# EAGLE design usv_board (EAGLE 8.4.2)
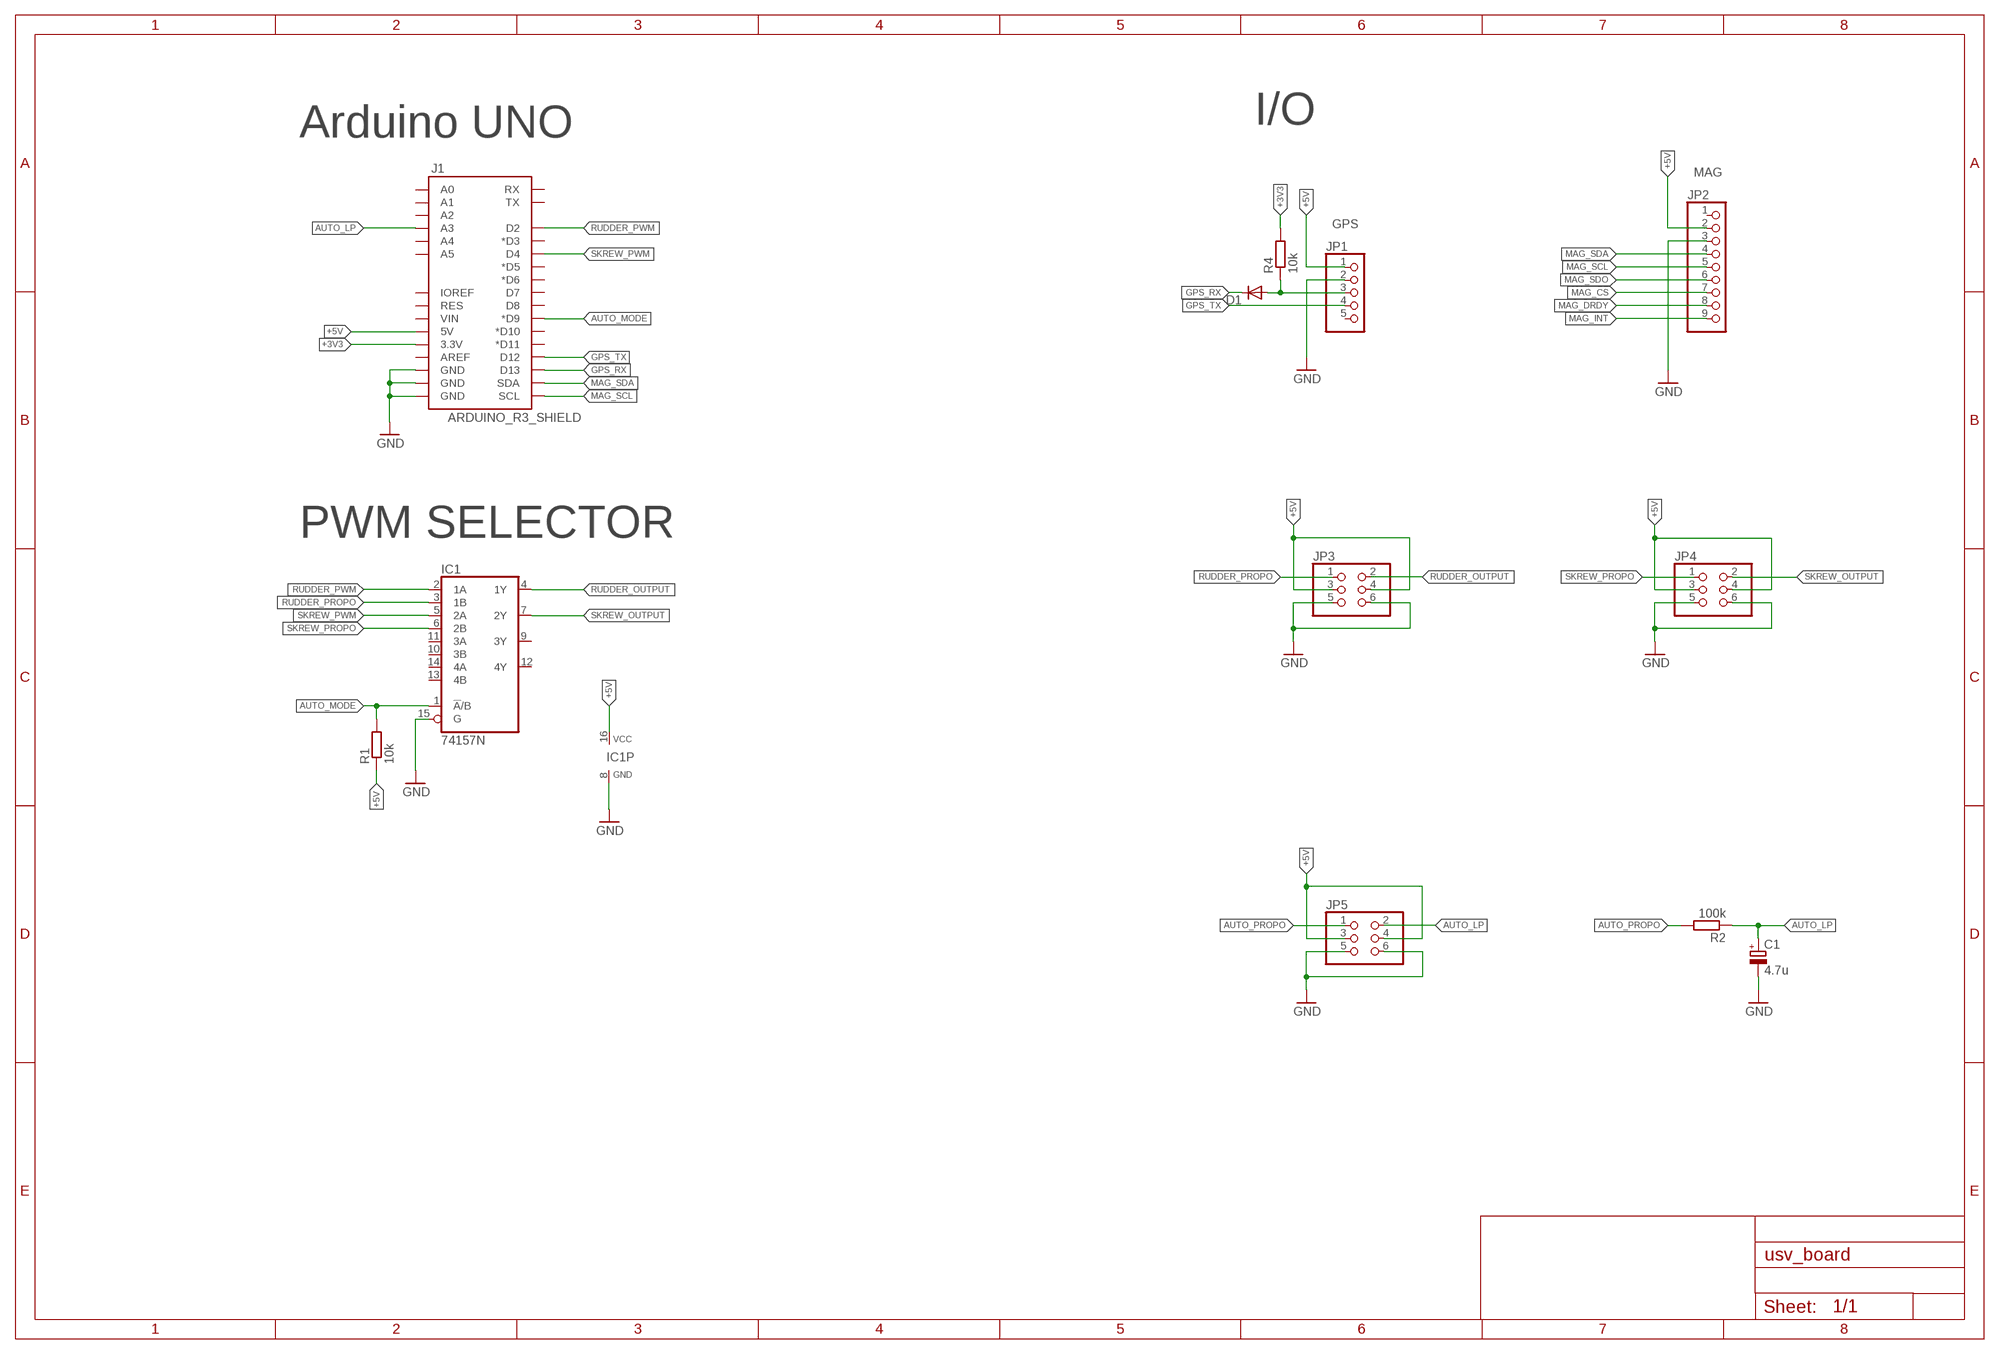
[diagram p0: schematic, sheet 1]

## Parts
C1  4.7u  CPOL-EUE2-4  [E2-4]
D1  DIODE-D-7.5  [D-7.5]
IC1  74157N  [DIL16]
J1  ARDUINO_R3_SHIELD  [UNO_R3_SHIELD]
JP1  PINHD-1X5  [1X05]
JP2  PINHD-1X9  [1X09]
JP3  PINHD-2X3  [2X03]
JP4  PINHD-2X3  [2X03]
JP5  PINHD-2X3  [2X03]
R1  10k  R-EU_0207/7  [0207/7]
R2  100k  R-EU_0207/7  [0207/7]
R4  10k  R-EU_0207/7  [0207/7]

## Nets
+3V3: J1.3.3V R4.2
+5V: IC1.16(VCC) J1.5V JP1.1 JP2.2 JP3.3 JP3.4 JP4.3 JP4.4 JP5.3 JP5.4 R1.1
AUTO_LP: C1.+ J1.A3 JP5.2 R2.1
AUTO_MODE: IC1.1(!A!/B) J1.D9(*D9) R1.2
AUTO_PROPO: JP5.1 R2.2
GND: C1.- IC1.8(GND) IC1.15(G) J1.GND@0(GND) J1.GND@1(GND) J1.GND@2(GND) JP1.2 JP2.3 JP3.5 JP3.6 JP4.5 JP4.6 JP5.5 JP5.6
GPS_RX: D1.C J1.D13
GPS_TX: J1.D12 JP1.4
MAG_CS: JP2.7
MAG_DRDY: JP2.8
MAG_INT: JP2.9
MAG_SCL: J1.SCL JP2.5
MAG_SDA: J1.SDA JP2.4
MAG_SDO: JP2.6
N$1: D1.A JP1.3 R4.1
RUDDER_OUTPUT: IC1.4(1Y) JP3.2
RUDDER_PROPO: IC1.3(1B) JP3.1
RUDDER_PWM: IC1.2(1A) J1.D2
SKREW_OUTPUT: IC1.7(2Y) JP4.2
SKREW_PROPO: IC1.6(2B) JP4.1
SKREW_PWM: IC1.5(2A) J1.D4
Unconnected: IC1.9(3Y) IC1.10(3B) IC1.11(3A) IC1.12(4Y) IC1.13(4B) IC1.14(4A) J1.A0 J1.A1 J1.A2 J1.A4 J1.A5 J1.AREF J1.D3(*D3) J1.D5(*D5) J1.D6(*D6) J1.D7 J1.D8 J1.D10(*D10) J1.D11(*D11) J1.IOREF J1.RES J1.RX J1.TX J1.VIN JP1.5 JP2.1

## Notes on the sheet
- Arduino UNO | I/O
- MAG
- GPS
- PWM SELECTOR

## Library data of the parts
C1 = resistor:CPOL-EU: POLARIZED CAPACITOR, European symbol
D1 = RoboJackets-Diodes:DIODE-: DIODE
IC1 = SparkFun-DigitalIC:74*157: Quadruple 2-line to 1-line data SELECTOR/MULTIPLEXER
J1 = SparkFun-Boards:ARDUINO_R3_SHIELD: Shield form compatible with the Arduino Uno R3.
JP1 = pinhead+:PINHD-1X5: PIN HEADER
JP2 = pinhead+:PINHD-1X9: PIN HEADER
JP3-JP5 = pinhead+:PINHD-2X3: PIN HEADER
R1 R2 R4 = resistor:R-EU_: RESISTOR, European symbol

## Board
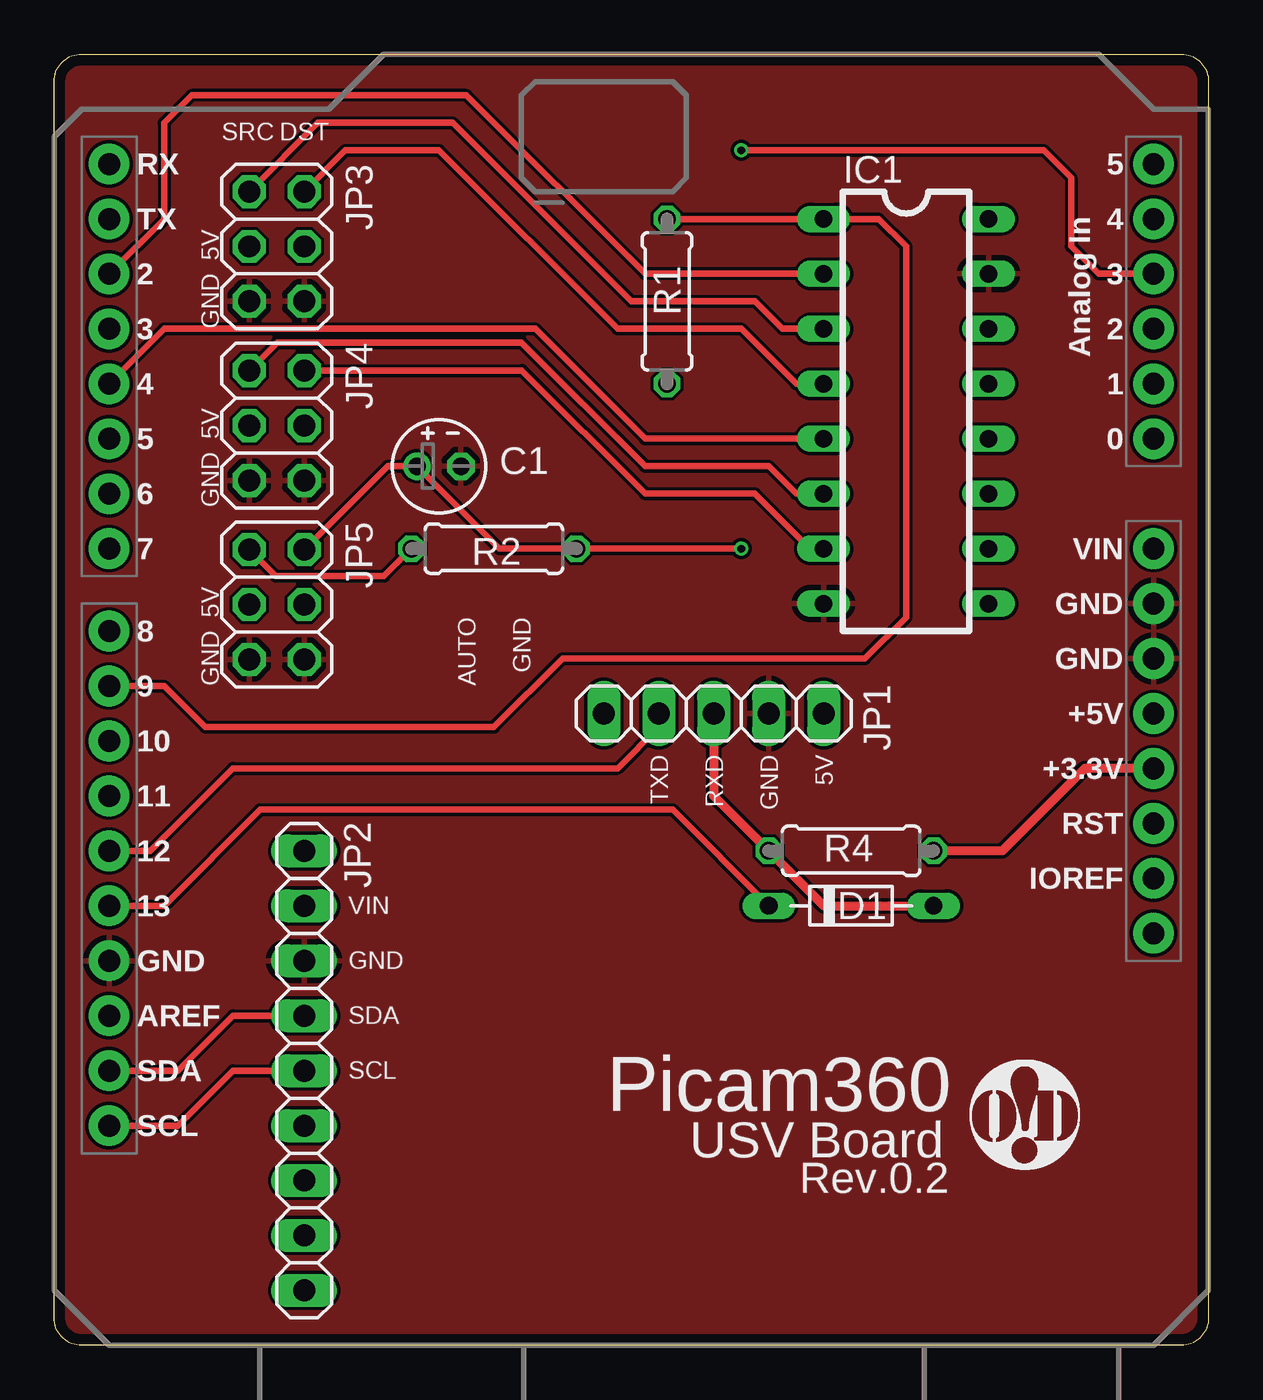
[diagram p1: board, top side]
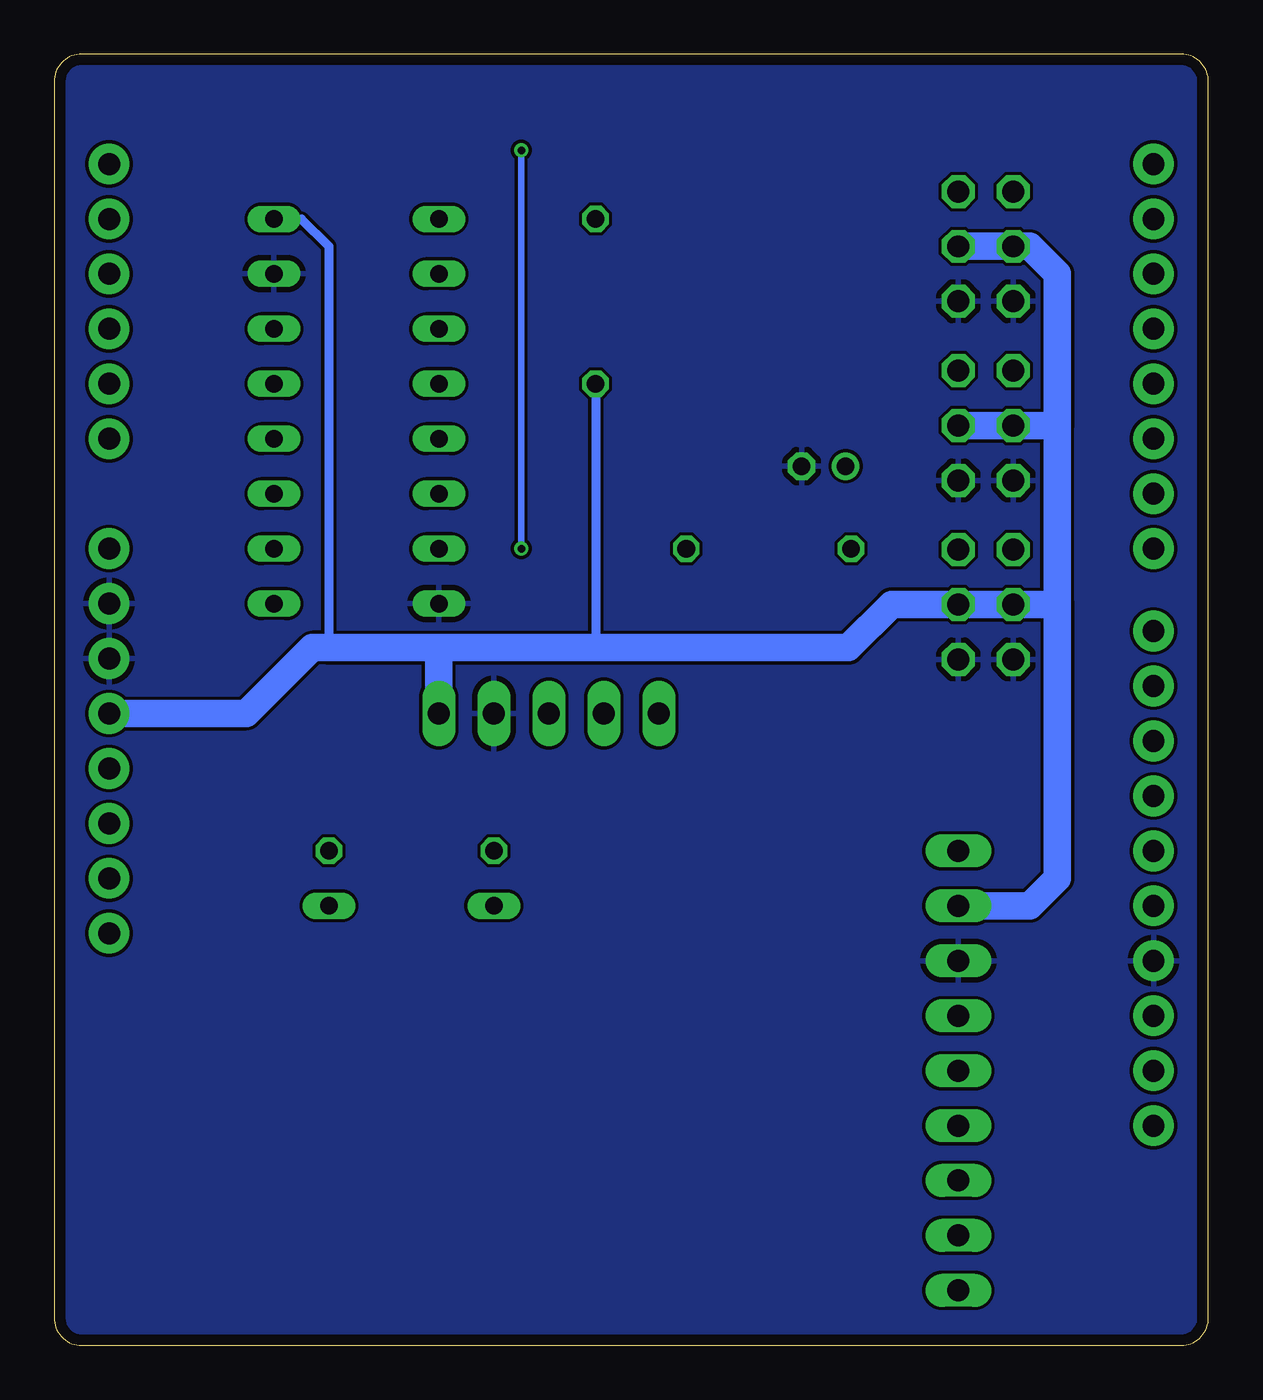
[diagram p2: board, bottom side, seen from below]

Size 53.34 x 59.69 mm. Coordinates in mm from the lower left corner, seen from the top.
Outline: 1.27,0 arc-90 0,1.27 0,58.42 arc-90 1.27,59.69 52.07,59.69 arc-90 53.34,58.42 53.34,1.27 arc-90 52.07,0 1.27,0
Copper layers (1*16): Top 0.035mm / dielectric 1.6mm / Bottom 0.035mm
Design rules "Elecrow_2-layer_PCB_eagle_rule": minimum track width 6mil, minimum drill 12mil, track to track 6mil, track to pad 6mil, pad to pad 6mil, via to via 8mil, smd to smd 0mil, copper to edge 20mil, drill to drill 10mil, minimum pad ring 6mil, minimum via ring 6mil, stop-mask expansion 0mil, vias tented up to drill 100mil, thermal gap 10mil

### Footprints (pad centres in the part's own frame; a part is rotated, then mirrored left to right if it is on the bottom)
E2-4 = drill 0.813 pad 1.27: + -1.016,0 | drill 0.813 pad 1.27 octagon: - 1.016,0
D-7.5 = drill 0.813 long: A 3.81,0; C -3.81,0
DIL16 = drill 0.813 long: 1 -8.89,-3.81; 2 -6.35,-3.81; 3 -3.81,-3.81; 4 -1.27,-3.81; 5 1.27,-3.81; 6 3.81,-3.81; 7 6.35,-3.81; 8 8.89,-3.81; 9 8.89,3.81; 10 6.35,3.81; 11 3.81,3.81; 12 1.27,3.81; 13 -1.27,3.81; 14 -3.81,3.81; 15 -6.35,3.81; 16 -8.89,3.81
UNO_R3_SHIELD = drill 1.016 pad 1.88: 3.3V 50.8,26.67; 5V 50.8,29.21; A0 50.8,41.91; A1 50.8,44.45; A2 50.8,46.99; A3 50.8,49.53; A4 50.8,52.07; A5 50.8,54.61; AREF 2.54,15.24; D2 2.54,49.53; D3 2.54,46.99; D4 2.54,44.45; D5 2.54,41.91; D6 2.54,39.37; D7 2.54,36.83; D8 2.54,33.02; D9 2.54,30.48; D10 2.54,27.94; D11 2.54,25.4; D12 2.54,22.86; D13 2.54,20.32; GND@0 50.8,31.75; GND@1 50.8,34.29; GND@2 2.54,17.78; IOREF 50.8,21.59; NC 50.8,19.05; RES 50.8,24.13; RX 2.54,54.61; SCL 2.54,10.16; SDA 2.54,12.7; TX 2.54,52.07; VIN 50.8,36.83
1X05 = drill 1.016 long: 1 -5.08,0; 2 -2.54,0; 3 0,0; 4 2.54,0; 5 5.08,0
1X09 = drill 1.016 long: 1 -10.16,0; 2 -7.62,0; 3 -5.08,0; 4 -2.54,0; 5 0,0; 6 2.54,0; 7 5.08,0; 8 7.62,0; 9 10.16,0
2X03 = drill 1.016 octagon: 1 -2.54,-1.27; 2 -2.54,1.27; 3 0,-1.27; 4 0,1.27; 5 2.54,-1.27; 6 2.54,1.27
0207/7 = drill 0.813 octagon: 1 -3.81,0; 2 3.81,0

### Placement (x,y rotation side)
C1  17.78,40.64 0 top
D1  36.83,20.32 0 top
IC1  39.37,43.18 270 top
J1  0,0 0 top
JP1  30.48,29.21 180 top
JP2  11.56,12.7 270 top
JP3  10.29,50.8 270 top
JP4  10.29,42.52 270 top
JP5  10.29,34.25 270 top
LOGO1  [OHMYDIGIFAB_LOGO]  44.86,10.62 0 top
R1  28.32,48.26 90 top
R2  20.32,36.83 180 top
R4  36.83,22.86 0 top

### Tracks (layer width: path | path; a pad name or v marks a point on that pad's centre or on a via)
+3V3
  Top 0.406: J1.3.3V 47.62,26.67 43.81,22.86 R4.2
+5V
  Bottom 0.406: R1.1 28.32,32.64 | IC1.16 41.91,52.07 40.64,50.8 40.64,32.26
  Bottom 0.508: 28.32,32.64 27.94,32.26
  Bottom 1.27: J1.5V 44.45,29.21 41.4,32.26 40.64,32.26 35.56,32.26 | JP2.2 8.26,20.32 6.99,21.59 6.99,34.29 | JP1.1 35.56,32.26 | 35.56,32.26 27.94,32.26 16.64,32.26 14.64,34.25 JP5.4 JP5.3 7.03,34.25 6.99,34.29 | JP3.3 JP3.4 8.26,50.8 6.99,49.53 6.99,42.55 | JP4.4 JP4.3 7,42.52 6.99,42.55 | 6.99,34.29 6.99,42.55
AUTO_LP  (via drill 0.35)
  Top 0.305: JP5.2 15.41,40.64 C1.+ 20.57,36.83 R2.1 v31.75,36.83 | v31.75,55.24 45.72,55.24 46.99,53.98 46.99,50.8 48.26,49.53 J1.A3
  Bottom 0.305: v31.75,36.83 v31.75,55.24
AUTO_MODE
  Top 0.305: R1.2 IC1.1 38.1,52.07 39.37,50.8 39.37,33.66 37.47,31.75 23.5,31.75 20.32,28.57 6.99,28.57 5.08,30.48 J1.D9
AUTO_PROPO
  Top 0.305: JP5.1 10.25,35.56 15.24,35.56 R2.2
GND
  pour Top: 0,59.69 0,0 53.34,0 53.34,59.69
  pour Bottom: 0,59.69 0,0 53.34,0 53.34,59.69
GPS_RX
  Top 0.305: J1.D13 5.08,20.32 9.53,24.77 28.57,24.77 D1.C
GPS_TX
  Top 0.305: J1.D12 4.45,22.86 8.26,26.67 26.04,26.67 27.94,28.57 JP1.4
MAG_SCL
  Top 0.305: J1.SCL 5.71,10.16 8.26,12.7 JP2.5
MAG_SDA
  Top 0.305: J1.SDA 5.71,12.7 8.26,15.24 JP2.4
N$1
  Top 0.406: JP1.3 30.48,25.4 R4.1 35.56,20.32 D1.A
RUDDER_OUTPUT
  Top 0.305: JP3.2 13.46,55.24 17.78,55.24 26.04,46.99 31.75,46.99 34.29,44.45 IC1.4
RUDDER_PROPO
  Top 0.305: JP3.1 12.19,56.52 18.41,56.52 26.67,48.26 32.38,48.26 33.66,46.99 IC1.3
RUDDER_PWM
  Top 0.305: IC1.2 27.3,49.53 19.05,57.78 6.35,57.78 5.08,56.52 5.08,52.07 J1.D2
SKREW_OUTPUT
  Top 0.305: JP4.2 21.61,45.06 27.3,39.37 32.38,39.37 34.92,36.83 IC1.7
SKREW_PROPO
  Top 0.305: JP4.1 10.31,46.35 21.59,46.35 27.3,40.64 33.02,40.64 34.29,39.37 IC1.6
SKREW_PWM
  Top 0.305: J1.D4 5.08,46.99 22.23,46.99 27.3,41.91 IC1.5

### Text on the board
tPlace: Picam360 | USV Board | Rev.0.2
tNames: SRC | DST | 5V | GND | 5V | GND | 5V | AUTO | GND | GND | TXD | RXD | GND | 5V | VIN | GND | SDA | SCL